# EAGLE schematic Motherboard Rev A (EAGLE 8.0.1)
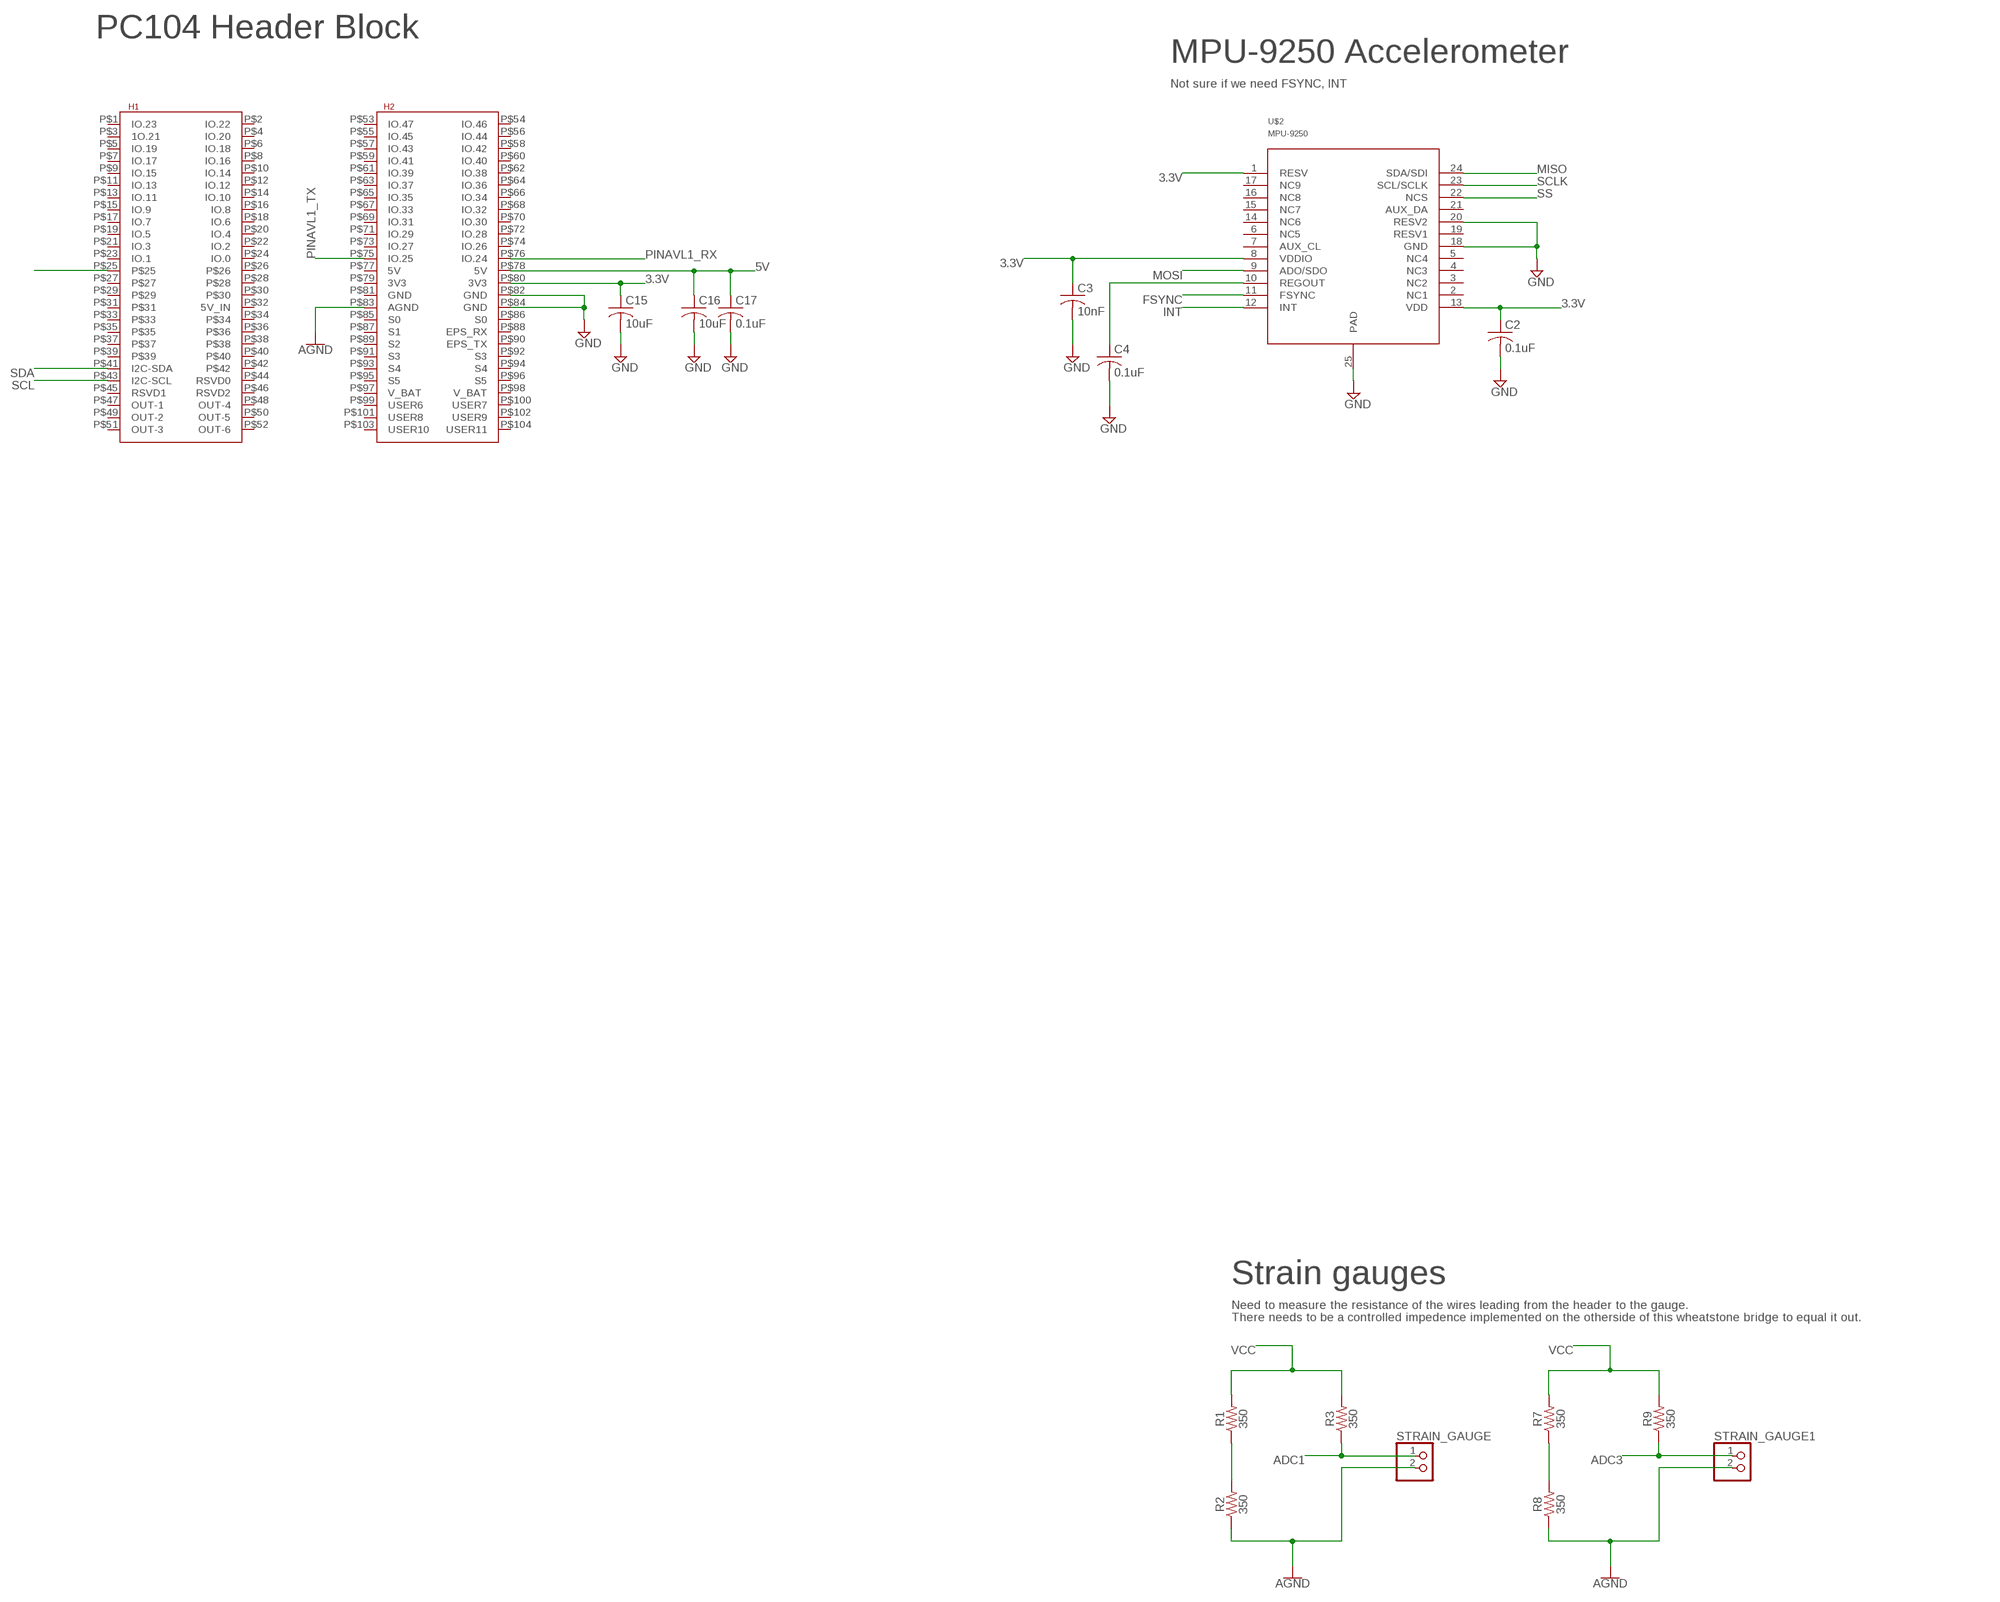
[diagram p0: schematic, sheet 1, part 1 of 2]
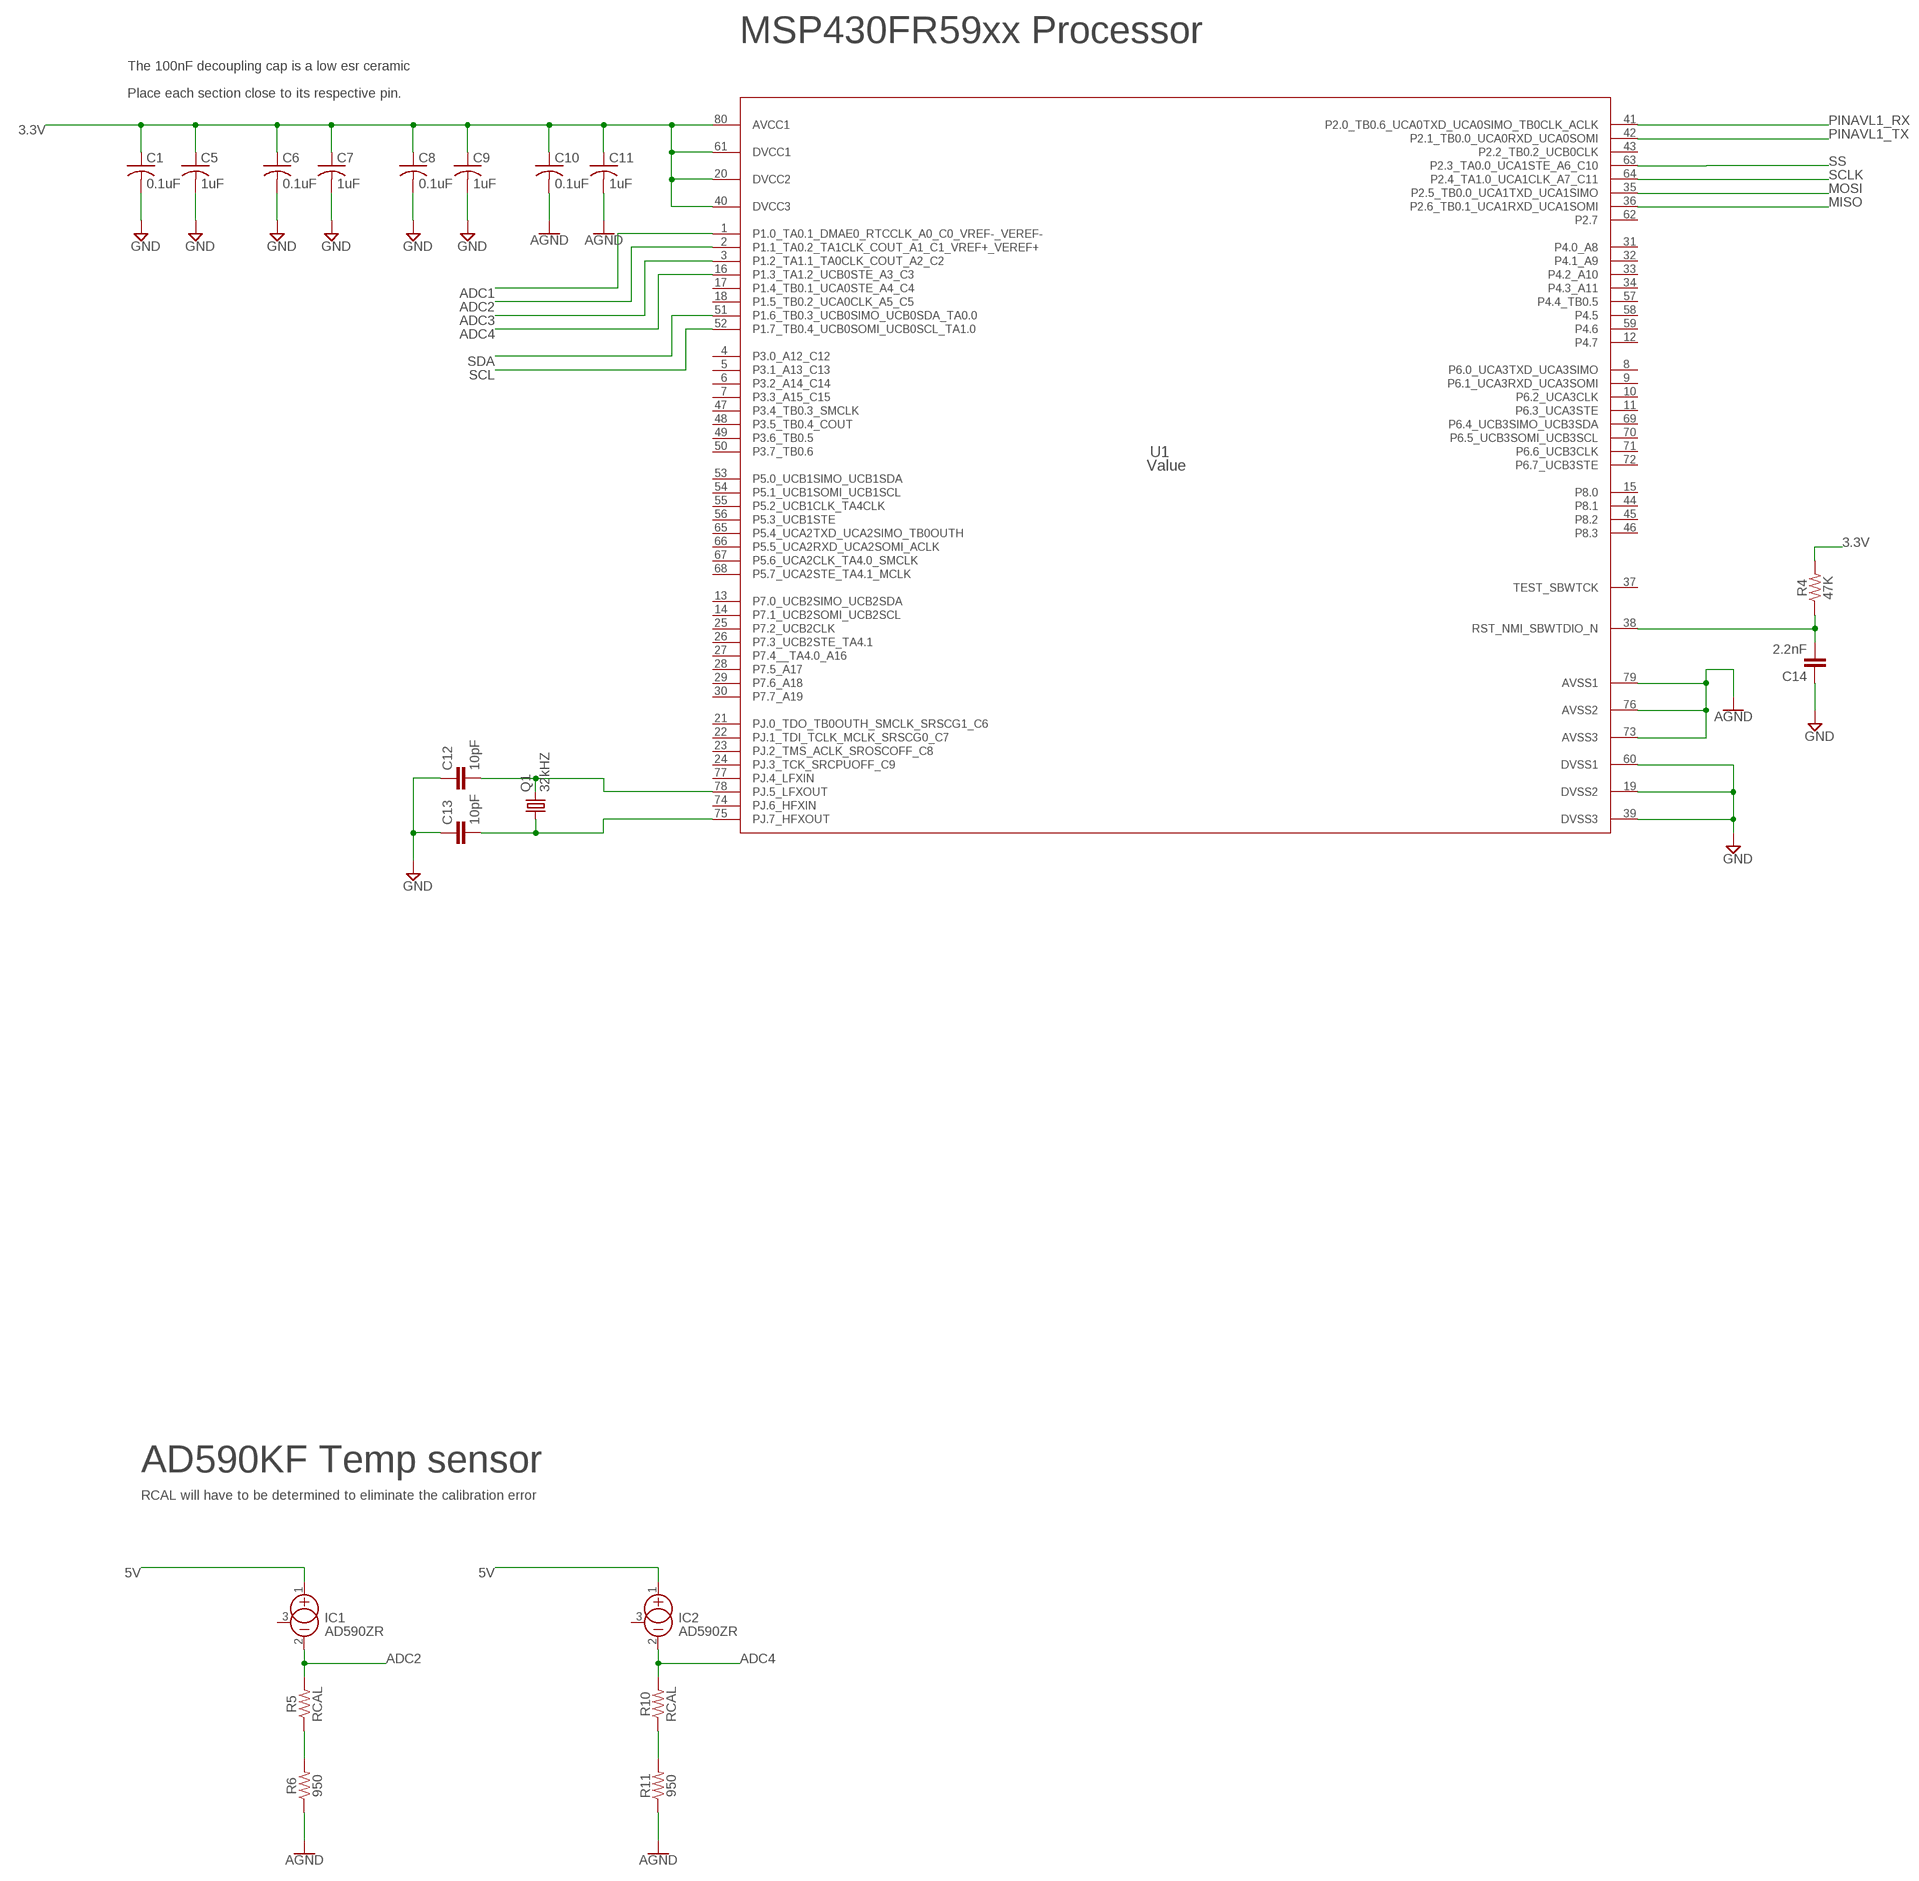
[diagram p1: schematic, sheet 1, part 2 of 2]

## Parts
C1  0.1uF  C-USC0603  [C0603]
C2  0.1uF  C-USC0603  [C0603]
C3  10nF  C-USC0603  [C0603]
C4  0.1uF  C-USC0603  [C0603]
C5  1uF  C-USC0603  [C0603]
C6  0.1uF  C-USC0603  [C0603]
C7  1uF  C-USC0603  [C0603]
C8  0.1uF  C-USC0603  [C0603]
C9  1uF  C-USC0603  [C0603]
C10  0.1uF  C-USC0603  [C0603]
C11  1uF  C-USC0603  [C0603]
C12  10pF  560PF-0603-50V-5%  [0603]
C13  10pF  560PF-0603-50V-5%  [0603]
C14  2.2nF  560PF-0603-50V-5%  [0603]
C15  10uF  C-USC0603  [C0603]
C16  10uF  C-USC0603  [C0603]
C17  0.1uF  C-USC0603  [C0603]
IC1  AD590ZR  [TO92]
IC2  AD590ZR  [TO92]
Q1  32kHZ  CRYSTALHC49S  [HC49/S]
R1  350  12.1KOHM-0603-1/10W-1%  [0603]
R2  350  12.1KOHM-0603-1/10W-1%  [0603]
R3  350  12.1KOHM-0603-1/10W-1%  [0603]
R4  47K  12.1KOHM-0603-1/10W-1%  [0603]
R5  RCAL  12.1KOHM-0603-1/10W-1%  [0603]
R6  950  12.1KOHM-0603-1/10W-1%  [0603]
R7  350  12.1KOHM-0603-1/10W-1%  [0603]
R8  350  12.1KOHM-0603-1/10W-1%  [0603]
R9  350  12.1KOHM-0603-1/10W-1%  [0603]
R10  RCAL  12.1KOHM-0603-1/10W-1%  [0603]
R11  950  12.1KOHM-0603-1/10W-1%  [0603]
STRAIN_GAUGE  PINHD-1X2  [1X02]
STRAIN_GAUGE1  PINHD-1X2  [1X02]
U1  Value  MSP430FR5994IPNR  [PN0080A_N]
U$1  PC104  [PC104]
U$2  MPU-9250  [LEAD-QFN24]

## Nets
3.3V: C1.1 C2.1 C3.1 C5.1 C6.1 C7.1 C8.1 C9.1 C10.1 C11.1 C15.1 R4.2 U1.20(DVCC2) U1.40(DVCC3) U1.61(DVCC1) U1.80(AVCC1) U$1.P$80(3V3) U$2.1(RESV) U$2.8(VDDIO) U$2.13(VDD)
5V: C16.1 C17.1 IC1.1(+) IC2.1(+) U$1.P$78(5V)
ADC1: R3.1 STRAIN_GAUGE.1 U1.1(P1.0_TA0.1_DMAE0_RTCCLK_A0_C0_VREF-_VEREF-)
ADC2: IC1.2(-) R5.2 U1.2(P1.1_TA0.2_TA1CLK_COUT_A1_C1_VREF+_VEREF+)
ADC3: R9.1 STRAIN_GAUGE1.1 U1.3(P1.2_TA1.1_TA0CLK_COUT_A2_C2)
ADC4: IC2.2(-) R10.2 U1.16(P1.3_TA1.2_UCB0STE_A3_C3)
AGND: C10.2 C11.2 R2.1 R6.1 R8.1 R11.1 STRAIN_GAUGE1.2 STRAIN_GAUGE.2 U1.73(AVSS3) U1.76(AVSS2) U1.79(AVSS1) U$1.P$83(AGND)
FSYNC: U$2.11(FSYNC)
GND: C1.2 C2.2 C3.2 C4.2 C5.2 C6.2 C7.2 C8.2 C9.2 C12.1 C13.1 C14.1 C15.2 C16.2 C17.2 U1.19(DVSS2) U1.39(DVSS3) U1.60(DVSS1) U$1.P$82(GND) U$1.P$84(GND) U$2.18(GND) U$2.20(RESV2) U$2.25(PAD)
INT: U$2.12(INT)
MISO: U1.36(P2.6_TB0.1_UCA1RXD_UCA1SOMI) U$2.24(SDA/SDI)
MOSI: U1.35(P2.5_TB0.0_UCA1TXD_UCA1SIMO) U$2.9(ADO/SDO)
N$1: C12.2 Q1.2 U1.78(PJ.5_LFXOUT)
N$2: R1.1 R2.2
N$3: C4.1 U$2.10(REGOUT)
N$4: U$1.P$25
N$5: C13.2 Q1.1 U1.75(PJ.7_HFXOUT)
N$6: R7.1 R8.2
N$7: C14.2 R4.1 U1.38(RST_NMI_SBWTDIO_N)
N$8: R10.1 R11.2
N$9: R5.1 R6.2
PINAVL1_RX: U1.41(P2.0_TB0.6_UCA0TXD_UCA0SIMO_TB0CLK_ACLK) U$1.P$76(IO.24)
PINAVL1_TX: U1.42(P2.1_TB0.0_UCA0RXD_UCA0SOMI) U$1.P$75(IO.25)
SCL: U1.52(P1.7_TB0.4_UCB0SOMI_UCB0SCL_TA1.0) U$1.P$43(I2C-SCL)
SCLK: U1.64(P2.4_TA1.0_UCA1CLK_A7_C11) U$2.23(SCL/SCLK)
SDA: U1.51(P1.6_TB0.3_UCB0SIMO_UCB0SDA_TA0.0) U$1.P$41(I2C-SDA)
SS: U1.63(P2.3_TA0.0_UCA1STE_A6_C10) U$2.22(NCS)
VCC: R1.2 R3.2 R7.2 R9.2
Unconnected: IC1.3(CAN) IC2.3(CAN) U1.4(P3.0_A12_C12) U1.5(P3.1_A13_C13) U1.6(P3.2_A14_C14) U1.7(P3.3_A15_C15) U1.8(P6.0_UCA3TXD_UCA3SIMO) U1.9(P6.1_UCA3RXD_UCA3SOMI) U1.10(P6.2_UCA3CLK) U1.11(P6.3_UCA3STE) U1.12(P4.7) U1.13(P7.0_UCB2SIMO_UCB2SDA) U1.14(P7.1_UCB2SOMI_UCB2SCL) U1.15(P8.0) U1.17(P1.4_TB0.1_UCA0STE_A4_C4) U1.18(P1.5_TB0.2_UCA0CLK_A5_C5) U1.21(PJ.0_TDO_TB0OUTH_SMCLK_SRSCG1_C6) U1.22(PJ.1_TDI_TCLK_MCLK_SRSCG0_C7) U1.23(PJ.2_TMS_ACLK_SROSCOFF_C8) U1.24(PJ.3_TCK_SRCPUOFF_C9) U1.25(P7.2_UCB2CLK) U1.26(P7.3_UCB2STE_TA4.1) U1.27(P7.4__TA4.0_A16) U1.28(P7.5_A17) U1.29(P7.6_A18) U1.30(P7.7_A19) U1.31(P4.0_A8) U1.32(P4.1_A9) U1.33(P4.2_A10) U1.34(P4.3_A11) U1.37(TEST_SBWTCK) U1.43(P2.2_TB0.2_UCB0CLK) U1.44(P8.1) U1.45(P8.2) U1.46(P8.3) U1.47(P3.4_TB0.3_SMCLK) U1.48(P3.5_TB0.4_COUT) U1.49(P3.6_TB0.5) U1.50(P3.7_TB0.6) U1.53(P5.0_UCB1SIMO_UCB1SDA) U1.54(P5.1_UCB1SOMI_UCB1SCL) U1.55(P5.2_UCB1CLK_TA4CLK) U1.56(P5.3_UCB1STE) U1.57(P4.4_TB0.5) U1.58(P4.5) U1.59(P4.6) U1.62(P2.7) U1.65(P5.4_UCA2TXD_UCA2SIMO_TB0OUTH) U1.66(P5.5_UCA2RXD_UCA2SOMI_ACLK) U1.67(P5.6_UCA2CLK_TA4.0_SMCLK) U1.68(P5.7_UCA2STE_TA4.1_MCLK) U1.69(P6.4_UCB3SIMO_UCB3SDA) U1.70(P6.5_UCB3SOMI_UCB3SCL) U1.71(P6.6_UCB3CLK) U1.72(P6.7_UCB3STE) U1.74(PJ.6_HFXIN) U1.77(PJ.4_LFXIN) U$1.P$1(IO.23) U$1.P$2(IO.22) U$1.P$3(1O.21) U$1.P$4(IO.20) U$1.P$5(IO.19) U$1.P$6(IO.18) U$1.P$7(IO.17) U$1.P$8(IO.16) U$1.P$9(IO.15) U$1.P$10(IO.14) U$1.P$11(IO.13) U$1.P$12(IO.12) U$1.P$13(IO.11) U$1.P$14(IO.10) U$1.P$15(IO.9) U$1.P$16(IO.8) U$1.P$17(IO.7) U$1.P$18(IO.6) U$1.P$19(IO.5) U$1.P$20(IO.4) U$1.P$21(IO.3) U$1.P$22(IO.2) U$1.P$23(IO.1) U$1.P$24(IO.0) U$1.P$26 U$1.P$27 U$1.P$28 U$1.P$29 U$1.P$30 U$1.P$31 U$1.P$32(5V_IN) U$1.P$33 U$1.P$34 U$1.P$35 U$1.P$36 U$1.P$37 U$1.P$38 U$1.P$39 U$1.P$40 U$1.P$42 U$1.P$44(RSVD0) U$1.P$45(RSVD1) U$1.P$46(RSVD2) U$1.P$47(OUT-1) U$1.P$48(OUT-4) U$1.P$49(OUT-2) U$1.P$50(OUT-5) U$1.P$51(OUT-3) U$1.P$52(OUT-6) U$1.P$53(IO.47) U$1.P$54(IO.46) U$1.P$55(IO.45) U$1.P$56(IO.44) U$1.P$57(IO.43) U$1.P$58(IO.42) U$1.P$59(IO.41) U$1.P$60(IO.40) U$1.P$61(IO.39) U$1.P$62(IO.38) U$1.P$63(IO.37) U$1.P$64(IO.36) U$1.P$65(IO.35) U$1.P$66(IO.34) U$1.P$67(IO.33) U$1.P$68(IO.32) U$1.P$69(IO.31) U$1.P$70(IO.30) U$1.P$71(IO.29) U$1.P$72(IO.28) U$1.P$73(IO.27) U$1.P$74(IO.26) U$1.P$77(5V) U$1.P$79(3V3) U$1.P$81(GND) U$1.P$85(S0) U$1.P$86(S0) U$1.P$87(S1) U$1.P$88(EPS_RX) U$1.P$89(S2) U$1.P$90(EPS_TX) U$1.P$91(S3) U$1.P$92(S3) U$1.P$93(S4) U$1.P$94(S4) U$1.P$95(S5) U$1.P$96(S5) U$1.P$97(V_BAT) U$1.P$98(V_BAT) U$1.P$99(USER6) U$1.P$100(USER7) U$1.P$101(USER8) U$1.P$102(USER9) U$1.P$103(USER10) U$1.P$104(USER11) U$2.2(NC1) U$2.3(NC2) U$2.4(NC3) U$2.5(NC4) U$2.6(NC5) U$2.7(AUX_CL) U$2.14(NC6) U$2.15(NC7) U$2.16(NC8) U$2.17(NC9) U$2.19(RESV1) U$2.21(AUX_DA)

## Notes on the sheet
- MSP430FR59xx Processor
- The 100nF decoupling cap is a low esr ceramic
- PC104 Header Block
- Place each section close to its respective pin.
- MPU-9250 Accelerometer
- Not sure if we need FSYNC, INT
- Strain gauges | AD590KF Temp sensor
- Need to measure the resistance of the wires leading from the header to the gauge. | RCAL will have to be determined to eliminate the calibration error
- There needs to be a controlled impedence implemented on the otherside of this wheatstone bridge to equal it out.

## Library data of the parts
C1-C11 C15-C17 = adafruit:C-US: CAPACITOR, American symbol
C12-C14 = SparkFun-Capacitors:560PF: 0.56nF/560pF ceramic capacitors A capacitor is a passive two-terminal electrical component used to store electrical energy temporarily in an electric field.; PROD_ID: CAP-08749; VALUE: 560pF
IC1 IC2 = linear4:AD590ZR: TEMPERATURE SENSOR current output
Q1 = crystal:CRYSTAL: CRYSTAL; OC_FARNELL: 1667008; OC_NEWARK: unknown
R1-R11 = SparkFun-Resistors:12.1KOHM: 12.1kΩ resistor A resistor is a passive two-terminal electrical component that implements electrical resistance as a circuit element. Resistors act to reduce current flow, and, at the same time, act to lower voltage levels within circuits. - Wikipedia; PROD_ID: RES-09378; VALUE: 12.1k
STRAIN_GAUGE STRAIN_GAUGE1 = pinhead:PINHD-1X2: PIN HEADER
U1 = VT_Parts_Eagle:MSP430FR5994IPNR; MANUFACTURER: Texas Instruments; PARTNUMBER: MSP430FR5994IPNR; REFDES: RefDes; TYPE: TYPE
U$1 = Cubesat:PC104
U$2 = VT_Parts_Eagle:MPU-9250